# Altium schematic sheet EtherCAT-INPUT.SchDoc
size B
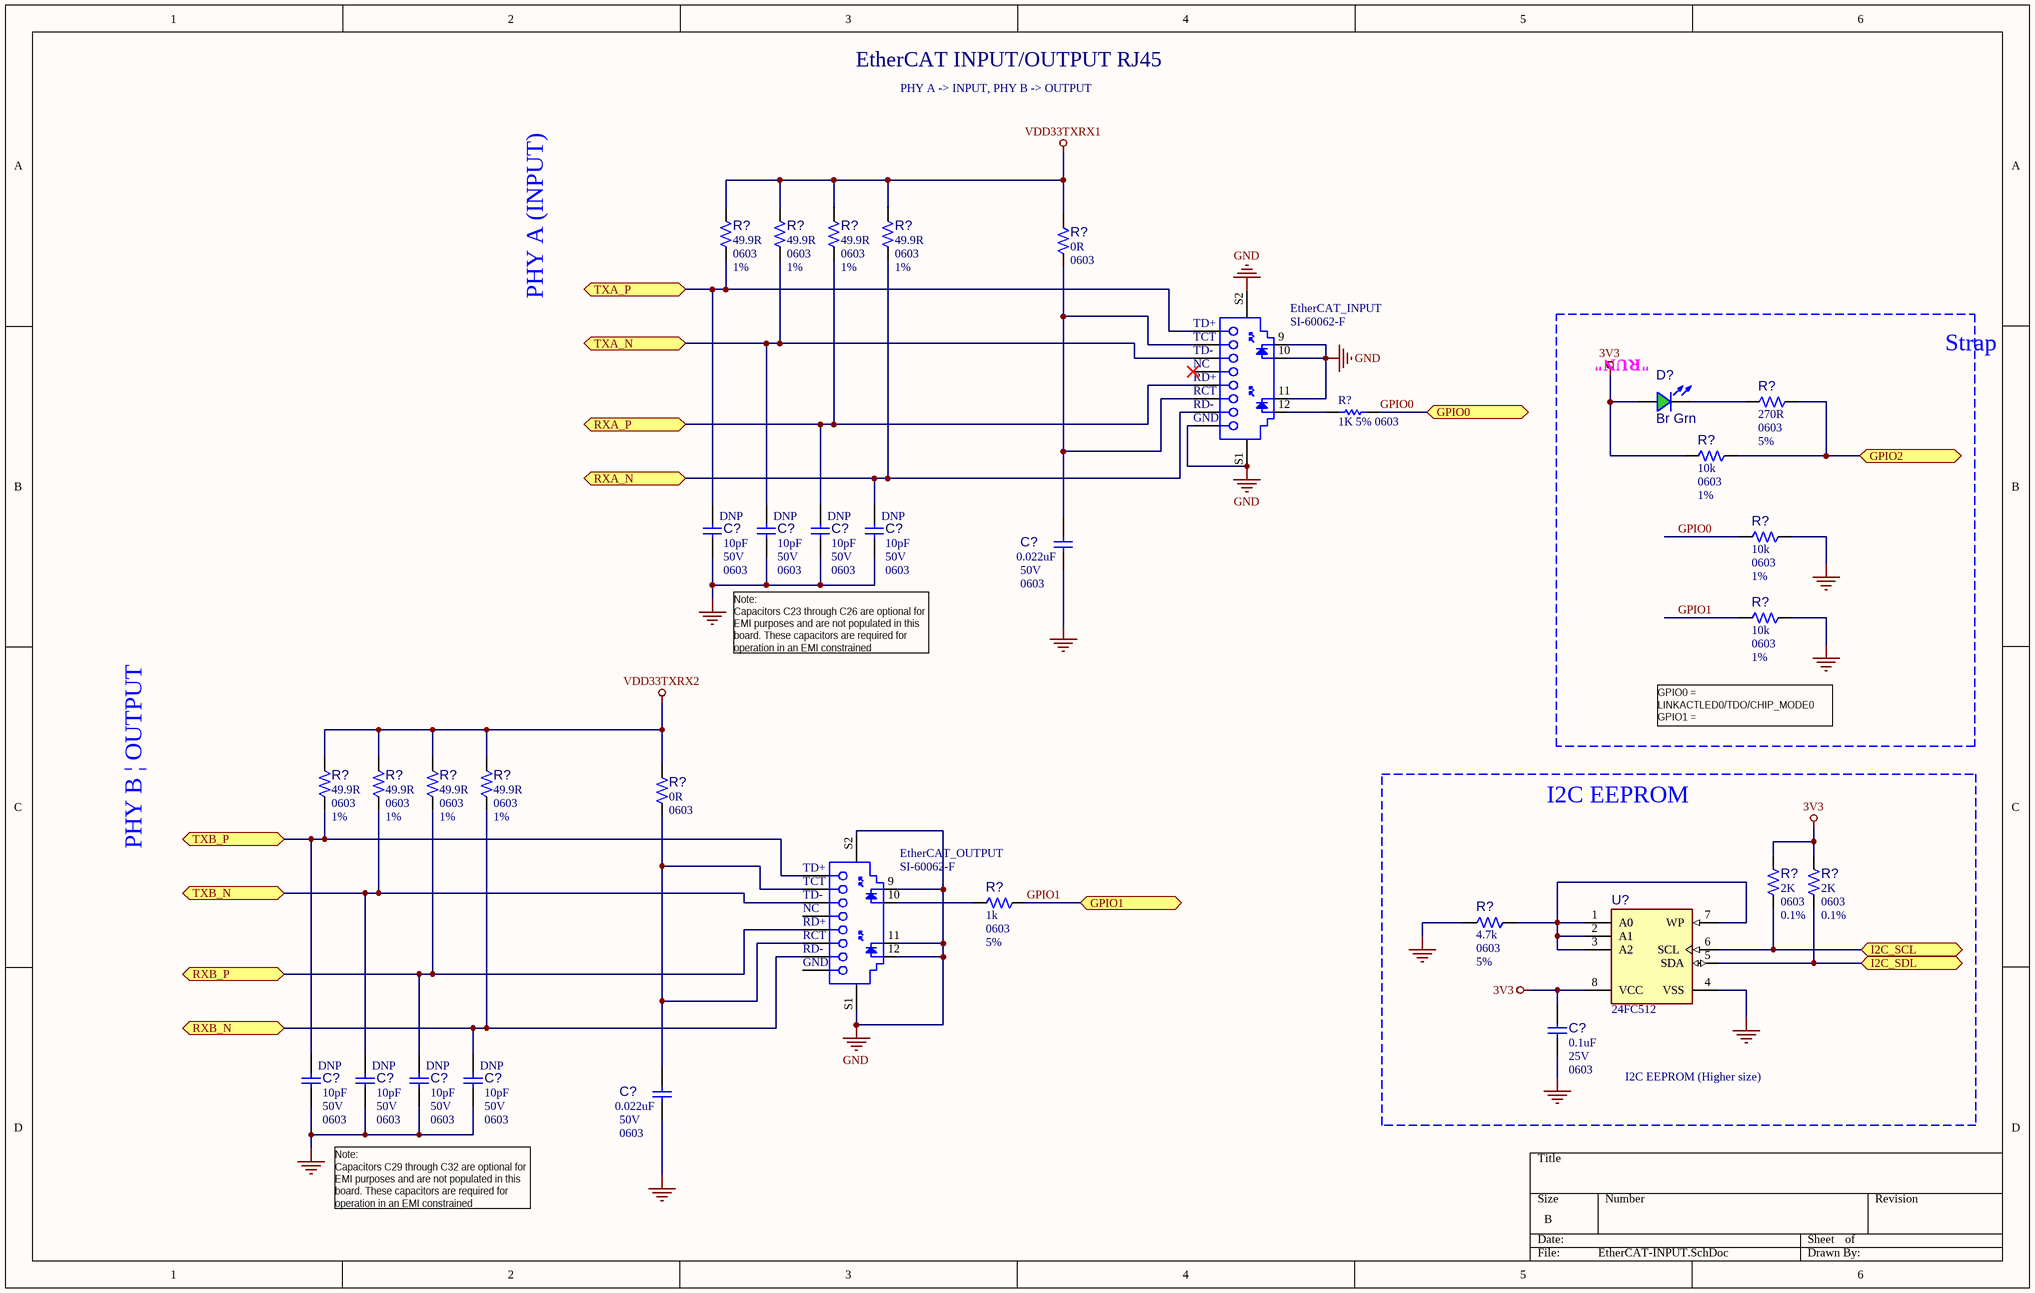
[diagram p0: EtherCAT-INPUT.SchDoc]

## Parts
(Parts that share a designator on the sheet are numbered #1, #2 ... from top to bottom, then left to right.)
C?#1  value 10pF  Voltage: 50V  Package: 0603  Populated: DNP  [CAP_C_0603]  (hidden comment: Capacitor NP)
C?#2  value 10pF  Voltage: 50V  Package: 0603  Populated: DNP  [CAP_C_0603]  (hidden comment: Capacitor NP)
C?#3  value 10pF  Voltage: 50V  Package: 0603  Populated: DNP  [CAP_C_0603]  (hidden comment: Capacitor NP)
C?#4  value 10pF  Voltage: 50V  Package: 0603  Populated: DNP  [CAP_C_0603]  (hidden comment: Capacitor NP)
C?#5  value 0.022uF  Voltage: 50V  Package: 0603  [CAP_C_0603]  (hidden comment: Capacitor NP)
C?#6  value 0.1uF  Voltage: 25V  Package: 0603  [CAP_C_0603]  (hidden comment: Capacitor NP)
C?#7  value 10pF  Voltage: 50V  Package: 0603  Populated: DNP  [CAP_C_0603]  (hidden comment: Capacitor NP)
C?#8  value 10pF  Voltage: 50V  Package: 0603  Populated: DNP  [CAP_C_0603]  (hidden comment: Capacitor NP)
C?#9  value 10pF  Voltage: 50V  Package: 0603  Populated: DNP  [CAP_C_0603]  (hidden comment: Capacitor NP)
C?#10  value 10pF  Voltage: 50V  Package: 0603  Populated: DNP  [CAP_C_0603]  (hidden comment: Capacitor NP)
C?#11  value 0.022uF  Voltage: 50V  Package: 0603  [CAP_C_0603]  (hidden comment: Capacitor NP)
D?  value Br Grn  [LED_0603_GREEN]  (hidden comment: LED, Bright Green, 0603)
EtherCAT_INPUT  SI-60062-F  [BELF-SI-60062-F_V]
EtherCAT_OUTPUT  SI-60062-F  [BELF-SI-60062-F_V]
R?#1  value 49.9R  Package: 0603  Tolerance: 1%  [RES_C_0603]  (hidden comment: Resistor)
R?#2  value 49.9R  Package: 0603  Tolerance: 1%  [RES_C_0603]  (hidden comment: Resistor)
R?#3  value 49.9R  Package: 0603  Tolerance: 1%  [RES_C_0603]  (hidden comment: Resistor)
R?#4  value 49.9R  Package: 0603  Tolerance: 1%  [RES_C_0603]  (hidden comment: Resistor)
R?#5  value 0R  Package: 0603  [RES_C_0603]  (hidden comment: Resistor)
R?#6  value 270R  Package: 0603  Tolerance: 5%  [RES_C_0603]  (hidden comment: Resistor)
R?#7  1K 5% 0603  [RESC1608X55X25NL10T15]
R?#8  value 10k  Package: 0603  Tolerance: 1%  [RES_C_0603]  (hidden comment: Resistor)
R?#9  value 10k  Package: 0603  Tolerance: 1%  [RES_C_0603]  (hidden comment: Resistor)
R?#10  value 10k  Package: 0603  Tolerance: 1%  [RES_C_0603]  (hidden comment: Resistor)
R?#11  value 49.9R  Package: 0603  Tolerance: 1%  [RES_C_0603]  (hidden comment: Resistor)
R?#12  value 49.9R  Package: 0603  Tolerance: 1%  [RES_C_0603]  (hidden comment: Resistor)
R?#13  value 49.9R  Package: 0603  Tolerance: 1%  [RES_C_0603]  (hidden comment: Resistor)
R?#14  value 49.9R  Package: 0603  Tolerance: 1%  [RES_C_0603]  (hidden comment: Resistor)
R?#15  value 0R  Package: 0603  [RES_C_0603]  (hidden comment: Resistor)
R?#16  value 1k  Package: 0603  Tolerance: 5%  [RES_C_0603]  (hidden comment: Resistor)
R?#17  value 2K  Package: 0603  Tolerance: 0.1%  [RES_C_0603]  (hidden comment: Resistor)
R?#18  value 2K  Package: 0603  Tolerance: 0.1%  [RES_C_0603]  (hidden comment: Resistor)
R?#19  value 4.7k  Package: 0603  Tolerance: 5%  [RES_C_0603]  (hidden comment: Resistor)
U?  24FC512  [SOIC-8]

## Blocks framed on the sheet
Strap: D? R?#6 R?#8-R?#10
I2C EEPROM: C?#6 R?#17-R?#19 U?

## Ports
GPIO0 (bidir), GPIO1 (bidir), GPIO2 (bidir), I2C_SCL (bidir), I2C_SDL (bidir), RXA_N (bidir), RXA_P (bidir), RXB_N (bidir), RXB_P (bidir), TXA_N (bidir), TXA_P (bidir), TXB_N (bidir), TXB_P (bidir)

## Nets
3V3: C?#6.2 D?.1(A) R?#8.2 R?#17.2 R?#18.2 U?.8(VCC)
GND: C?#1.1 C?#2.1 C?#3.1 C?#4.1 C?#5.1 C?#6.1 C?#7.1 C?#8.1 C?#9.1 C?#10.1 C?#11.1 EtherCAT_INPUT.8(GND) EtherCAT_INPUT.9 EtherCAT_INPUT.10 EtherCAT_INPUT.11 EtherCAT_INPUT.S1 EtherCAT_INPUT.S2 EtherCAT_OUTPUT.9 EtherCAT_OUTPUT.11 EtherCAT_OUTPUT.12 EtherCAT_OUTPUT.S1 EtherCAT_OUTPUT.S2 R?#9.1 R?#10.1 R?#19.1 U?.4(VSS)
VDD33TXRX1: R?#1.2 R?#2.2 R?#3.2 R?#4.2 R?#5.2
VDD33TXRX2: R?#11.2 R?#12.2 R?#13.2 R?#14.2 R?#15.2
GPIO0: R?#7.2 R?#9.2 ; port GPIO0
GPIO1: R?#10.2 R?#16.2 ; port GPIO1
GPIO2: R?#6.1 R?#8.1 ; port GPIO2
I2C_SCL: R?#17.1 U?.6(SCL) ; port I2C_SCL
I2C_SDL: R?#18.1 U?.5(SDA) ; port I2C_SDL
RXA_N: C?#4.2 EtherCAT_INPUT.7(RD-) R?#4.1 ; port RXA_N
RXA_P: C?#3.2 EtherCAT_INPUT.5(RD+) R?#3.1 ; port RXA_P
RXB_N: C?#10.2 EtherCAT_OUTPUT.7(RD-) R?#14.1 ; port RXB_N
RXB_P: C?#9.2 EtherCAT_OUTPUT.5(RD+) R?#13.1 ; port RXB_P
TXA_N: C?#2.2 EtherCAT_INPUT.3(TD-) R?#2.1 ; port TXA_N
TXA_P: C?#1.2 EtherCAT_INPUT.1(TD+) R?#1.1 ; port TXA_P
TXB_N: C?#8.2 EtherCAT_OUTPUT.3(TD-) R?#12.1 ; port TXB_N
TXB_P: C?#7.2 EtherCAT_OUTPUT.1(TD+) R?#11.1 ; port TXB_P
NetC?#5_2: C?#5.2 EtherCAT_INPUT.2(TCT) EtherCAT_INPUT.6(RCT) R?#5.1
NetC?#11_2: C?#11.2 EtherCAT_OUTPUT.2(TCT) EtherCAT_OUTPUT.6(RCT) R?#15.1
NetD?_2: D?.2(K) R?#6.2
NetEtherCAT_INPUT_12: EtherCAT_INPUT.12 R?#7.1
NetEtherCAT_OUTPUT_10: EtherCAT_OUTPUT.10 R?#16.1
NetR?#19_2: R?#19.2 U?.1(A0) U?.2(A1) U?.3(A2) U?.7(WP)

Not connected (* = marked no-connect by the designer): EtherCAT_INPUT 4(NC)*; EtherCAT_OUTPUT 4(NC) 8(GND)

## Notes on the sheet
- EtherCAT INPUT/OUTPUT RJ45
- PHY A -> INPUT, PHY B -> OUTPUT
- PHY A (INPUT)
- (near D?) "RUN"
- Note:
  Capacitors C23 through C26 are optional for EMI purposes and are not populated in this  board. These capacitors are required for operation in an EMI constrained environment.
- GPIO0 = LINKACTLED0/TDO/CHIP_MODE0
  GPIO1 = LINKACTLED1/TDI/CHIP_MODE1
  GPIO2 = RUNLED/E2PSIZE
- PHY B | OUTPUT
- I2C EEPROM (Higher size)
- Note:
  Capacitors C29 through C32 are optional for EMI purposes and are not populated in this  board. These capacitors are required for operation in an EMI constrained environment.

## Library data of the parts
C?#1-C?#4 C?#7-C?#10 = CAP0142: Capacitor; Manufacturer 1: KEMET; Manufacturer Part Number 1: C0603C100J5GAC; Description_: CAP CER 10pF 50V 5% NP0 SMD 0603; Tolerance: 5%; Temperature Coeffcient: NP0; Type: Ceramic; MCHP-ID: CAP0142; Revision: 1; Status: Production; ComponentLink1URL: https://chn-vm-apps.microchip.com/mchprepo/parts/Datasheets/KEM_C1002_X7R_SMD.pdf; ComponentLink1Description: Datasheet; Operating Temperature: -55C to +125C; Category: Capacitor; Manufacturer 2: KEMET; Manufacturer Part Number 2: C0603C100J5GACTU; Manufacturer 3: TDK; Manufacturer Part Number 3: C1608C0G1H100J; Manufacturer 4: Murata; Manufacturer Part Number 4: GRM1885C1H100JA01D; Supplier 1: KEMET; Supplier Part Number 1: C0603C100J5GAC; Supplier 2: Digi-Key; Supplier Part Number 2: 399-1049-2-ND; Supplier 3: Digi-Key; Supplier Part Number 3: 445-6852-1-ND; Supplier 4: Digi-Key; Supplier Part Number 4: 490-1403-2-ND; Supplier 5: Digi-Key; Supplier Part Number 5: 490-1403-1-ND; Quantity Override: 1
C?#5 C?#11 = CAP0625: Capacitor; Manufacturer 1: AVX; Manufacturer Part Number 1: 06035C223JAT2A; Description_: CAP CER 0.022uF 50V 5% X7R SMD 0603; Tolerance: 5%; Temperature Coeffcient: X7R; Type: Ceramic; Populated: YES; MCHP-ID: CAP0625; Revision: 1; Status: Production; ComponentLink1URL: https://chn-vm-apps.microchip.com/mchprepo/parts/Datasheets/smccp.pdf; ComponentLink1Description: Datasheet; Operating Temperature: -55C to +125C; Category: Capacitor; Supplier 1: Digi-Key; Supplier Part Number 1: 478-3722-2-ND; Quantity Override: 1
C?#6 = CAP0012: Capacitor; Manufacturer 1: Cal-Chip; Manufacturer Part Number 1: GMC10Y5V104Z25NTLF; Description_: CAP CER 0.1uF 25V 20% Y5V SMD 0603; Tolerance: 20%; Temperature Coeffcient: Y5V; Type: Ceramic; Populated: Yes; MCHP-ID: CAP0012; Revision: 1; Status: Production; ComponentLink1URL: https://chn-vm-apps.microchip.com/mchprepo/parts/Datasheets/nmc2.pdf; ComponentLink1Description: Datasheet; Operating Temperature: -30C to + 85C; Category: Capacitor; Manufacturer 2: NIC Components; Manufacturer Part Number 2: NMC0603Y5V104Z25TRPF; Manufacturer 3: Panasonic; Manufacturer Part Number 3: ECJ-1VF1E104Z; Manufacturer 4: ROHM; Manufacturer Part Number 4: MCH182FN104ZK; Manufacturer 5: Murata; Manufacturer Part Number 5: GRM188F51E104ZA01D; Supplier 1: Cal-Chip; Supplier Part Number 1: GMC10Y5V104Z25NTLF; Supplier 2: NIC Components; Supplier Part Number 2: NMC0603Y5V104Z25TRPF; Supplier 3: Digi-Key; Supplier Part Number 3: PCC1794TR-ND; Supplier 4: ROHM; Supplier Part Number 4: MCH182FN104ZK; Supplier 5: Raynen; Supplier Part Number 5: 490-1575-1-ND; Quantity Override: 1
D? = LED, Bright Green, 0603: Manufacturer 1: Lite-On; Manufacturer Part Number 1: LTST-C191KGKT; Type: LED Single; Forward Current: 20mA; MCD: 35mcd; Owner: Jennifer Hancock; Viewing Angle: 130°; Revision: -; Description_: LED, Bright Green, 0603; Package: 0603 (1608 Metric); ComponentLink1URL: http://optoelectronics.liteon.com/upload/download/DS22-2000-228/S_110_LTST-C191KGKT.pdf; ComponentLink1Description: Datasheet; Category: Diode; Mounting Type: Surface Mount; Supplier 1: Digi-Key; Supplier Part Number 1: 160-1446-6-ND
EtherCAT_INPUT EtherCAT_OUTPUT = CMP-2000-07059-1: 1 Port RJ45 Magjack Connector with Yellow and Green LED, 10/100 Base-T, 12-Pin THD, RoHS, Tray; Manufacturer: Bel Fuse; Number of Ways: 8P4C; Gender: Female; Shield Type: STP; Connector Type: RJ45; Contact Plating: Gold; Mounting Type: ThroughHole; Datasheet Version: Rev. B0, 09/2008; Package Reference: SI-60062-F; Manufacturer URL: http://belfuse.com/; Package Description: 12-Pin Through Hole Device, Body 21.59 x 16.13 mm; Series: MagJack; Contact Material: CopperAlloy; Datasheet URL: http://belfuse.com/pdfs/SI-60062-F.pdf; Width: 17.98mm; Length: 15.21mm; Mounting Technology: ThroughHole; Depth: 21.59mm; Orientation: Straight
R?#1-R?#4 R?#11-R?#14 = RES1188: Manufacturer 1: Panasonic; Manufacturer Part Number 1: ERJ-3EKF49R9V; Description_: RES TKF 49.9R 1% 1/10W SMD 0603; Voltage: 75V; Temperature Coeffcient: 100ppm/C; Power: 1/10W; Owner: Adrian T (M91397); Populated: Yes; MCHP-ID: RES1188; Revision: 0; Status: Production; ComponentLink1URL: https://chn-vm-apps.microchip.com/mchprepo/parts/Datasheets/AOA0000CE2.pdf; ComponentLink1Description: Datasheet; Operating Temperature: -55C to +155C; Category: Resistor; Type: RES SMD; Composition: TKF; Supplier 1: Digi-Key; Supplier Part Number 1: P49.9HCT-ND; Quantity Override: 1
R?#5 R?#15 = RSMT0001: Manufacturer 1: NIC Components; Manufacturer Part Number 1: NRC06Z0TRF; Description_: RES TKF 0R 1/10W SMD 0603; Power: 1/10W; Populated: Yes; MCHP-ID: RSMT0001; Revision: 2; Status: Production; ComponentLink1URL: https://chn-vm-apps.microchip.com/mchprepo/parts/Datasheets/nrc.pdf; ComponentLink1Description: Datasheet; Operating Temperature: -55C to +155C; Category: Resistor; Type: RES SMD; Composition: TKF; Manufacturer 2: Panasonic; Manufacturer Part Number 2: ERJ-3GSY0R00V; Manufacturer 3: Panasonic; Manufacturer Part Number 3: ERJ-3GEY0R00V; Manufacturer 4: Stackpole Electronics Inc; Manufacturer Part Number 4: RMCF0603ZT0R00; Manufacturer 5: Vishay; Manufacturer Part Number 5: CRCW06030000Z0EA; Manufacturer 6: Stackpole Electronics Inc; Manufacturer Part Number 6: RMCF 1/16 0 R; Manufacturer 7: Yageo; Manufacturer Part Number 7: RC0603JR-070RL; Manufacturer 8: KOA Speer; Manufacturer Part Number 8: RK73Z1JTTP; Manufacturer 9: ROHM; Manufacturer Part Number 9: MCR03EZPJ000; Supplier 1: NIC Components; Supplier Part Number 1: NRC06Z0TRF; Supplier 2: Digi-Key; Supplier Part Number 2: P0.0GTR-ND; Supplier 3: Digi-Key; Supplier Part Number 3: RMCF0603ZT0R00TR-ND; Supplier 4: Digi-Key; Supplier Part Number 4: RMCF0603ZT0R00CT-ND; Supplier 5: Digi-Key; Supplier Part Number 5: 541-0.0GCT-ND; Supplier 6: Digi-Key; Supplier Part Number 6: RMCF1/160RTR-ND; Supplier 7: Digi-Key; Supplier Part Number 7: 311-0.0GRCT-ND; Supplier 8: KOA Speer; Supplier Part Number 8: RK73Z1JTTP; Supplier 9: Digi-Key; Supplier Part Number 9: RHM0.0GCT-ND; Quantity Override: 1
R?#6 = RES1150: Manufacturer 1: Panasonic; Manufacturer Part Number 1: ERJ-3GEYJ271V; Description_: RES TKF 270R 5% 1/10W SMD 0603; Dev Tools Status: Production; Voltage: 75V; Temperature Coeffcient: 200ppm/C; Power: 1/10W; Owner: Bogdan P (M91398); Populated: Yes; MCHP-ID: RES1150; Revision: 0; Status: MCL Design; ComponentLink1URL: https://chn-vm-apps.microchip.com/mchprepo/parts/Datasheets/AOA0000CE1.pdf; ComponentLink1Description: Datasheet; Operating Temperature: -55C to +155C; Category: Resistor; Type: RES SMD; Composition: TKF; Supplier 1: Digi-Key; Supplier Part Number 1: P270GCT-ND; Quantity Override: 1
R?#7 = CMP-1659-00009-4: Chip Resistor, 1 KOhm, +/-1%, 0.1 W, -55 to 155 degC, 0603 (1608 Metric), RoHS, Tape and Reel; Manufacturer: Yageo; Voltage Rating: 50 V; ComponentLink2URL: http://www.yageo.com/documents/recent/PYu-RC_Group_51_RoHS_L_04.pdf; Max Operating Temperature: 155 degC; PackageDescription: 2-Pin Surface Mount Device, Body 1.6 x 0.8 mm; Packaging: Tape and Reel; ComponentLink3Description: Package Specification; REACH SVHC: No SVHC; Mount: Surface Mount; ComponentLink2Description: Datasheet; Length: 1.6 mm; PackageReference: 0603; Height: 0.45 mm; DatasheetVersion: Rev. 4, 02/2016; Min Operating Temperature: -55 degC; ComponentLink1Description: Manufacturer URL; Package Quantity: 200; RoHSCompliant: true; ComponentLink3URL: http://www.farnell.com/datasheets/443971.pdf; Pins: 2; Mounting Technology: Surface Mount; ComponentLink1URL: http://www.yageo.com/
R?#8-R?#10 = RES1368: Manufacturer 1: TE Connectivity; Manufacturer Part Number 1: 5-1879337-9; Description_: RES TF 10k 1% 1/16W SMD 0603; Voltage: 100V; Temperature Coeffcient: 50ppm/C; Circuit Type: Isolated; Power: 1/16W; Owner: Jairuz Agang-ang; Populated: YES; MCHP-ID: RES1368; Revision: 1; Status: Production; ComponentLink1URL: https://chn-vm-apps.microchip.com/mchprepo/parts/Datasheets/ENG_DS_1773200_H.pdf; ComponentLink1Description: Datasheet; Operating Temperature: -55C to +155C; Category: Resistor; Type: RES SMD; Composition: TF; Supplier 1: Digi-Key; Supplier Part Number 1: A102203CT-ND; Quantity Override: 1
R?#16 = RES1128: Manufacturer 1: Panasonic; Manufacturer Part Number 1: ERJ-3GEYJ102V; Description_: RES TKF 1k 5% 1/10W SMD 0603; Voltage: 75V; Temperature Coeffcient: 200ppm/C; Power: 1/10W; Owner: Bogdan P (M91398); Populated: Yes; MCHP-ID: RES1128; Revision: 0; Status: Production; ComponentLink1URL: https://chn-vm-apps.microchip.com/mchprepo/parts/Datasheets/AOA0000CE1.pdf; ComponentLink1Description: Datasheet; Operating Temperature: -55C to +155C; Category: Resistor; Type: RES SMD; Composition: TKF; Supplier 1: Digi-Key; Supplier Part Number 1: P1.0KGCT-ND; Quantity Override: 1
R?#17 R?#18 = RES1693: Manufacturer 1: Yageo; Manufacturer Part Number 1: RT0603BRD072KL; Description_: RES SMD 2K OHM 0.1% 1/10W 0603; Dev Tools Status: Design; Temperature Coeffcient: ±25ppm/°C; Power: 0.1W, 1/10W; Owner: Jose Garcia; Populated: YES; MCHP-ID: RES1693; Revision: 1; Symbol: Resistor; Status: MCL Design; ComponentLink1Description: Datasheet; Operating Temperature: -55°C ~ 155°C; Category: Resistor; Type: RES SMD; Composition: TF; Supplier 1: Digi-Key; Supplier Part Number 1: YAG1626CT-ND; Quantity Override: 1
R?#19 = RES1178: Manufacturer 1: Panasonic; Manufacturer Part Number 1: ERJ-3GEYJ472V; Description_: RES TKF 4.7k 5% 1/10W SMD 0603; Dev Tools Status: Production; Voltage: 75V; Temperature Coeffcient: 200ppm/C; Power: 1/10W; Owner: Bogdan P (M91398); Populated: Yes; MCHP-ID: RES1178; Revision: 0; Symbol: Resistor; Status: MCL Design; ComponentLink1URL: https://chn-vm-apps.microchip.com/mchprepo/parts/Datasheets/AOA0000CE1.pdf; ComponentLink1Description: Datasheet; Operating Temperature: -55C to +155C; Category: Resistor; Type: RES SMD; Composition: TKF; Supplier 1: Digi-Key; Supplier Part Number 1: P4.7KGCT-ND; Quantity Override: 1
U? = 24FC512: EEPROM I2C; Manufacturer 1: Microchip; Manufacturer Part Number 1: 24FC512T-I/SN; Description_: MCHP MEMORY SERIAL EEPROM 512k I2C 24FC512-I/SN SOIC-8; Symobl: 24XXXX SOIC-8; MAPS Description: 512K, 64K X 8 2.5V SERIAL EE, IND; Dev Tools Status: Production; PackingMedia: T/R; TempRange: -40C to +85C; LeadCount: 8; PackageWidth: 3.90mm(.150in); LeadContent: Pb-FREE; MemorySizeNum: 512000; OpVoltMin: 2.5; OpVoltMax: 5.5; MaxClockFreq: 400 kHz; AddressPins: 3; WPScheme: Full Array; MemoryOrg: x8; Populated: Yes; Type: Serial EEPROM; Category: MCHP-Memory; ComponentLink1URL: http://www.microchip.com/wwwproducts/en/24FC512; ComponentLink1Description: Datasheet; Manufacturer 2: Microchip; Manufacturer Part Number 2: 24FC512-I/SN; Supplier 1: Microchip; Supplier Part Number 1: 24FC512T-I/SN; Supplier 2: Microchip; Supplier Part Number 2: 24FC512-I/SN; PackageType: SOIC; Quantity Override: 1; Value: 24FC512